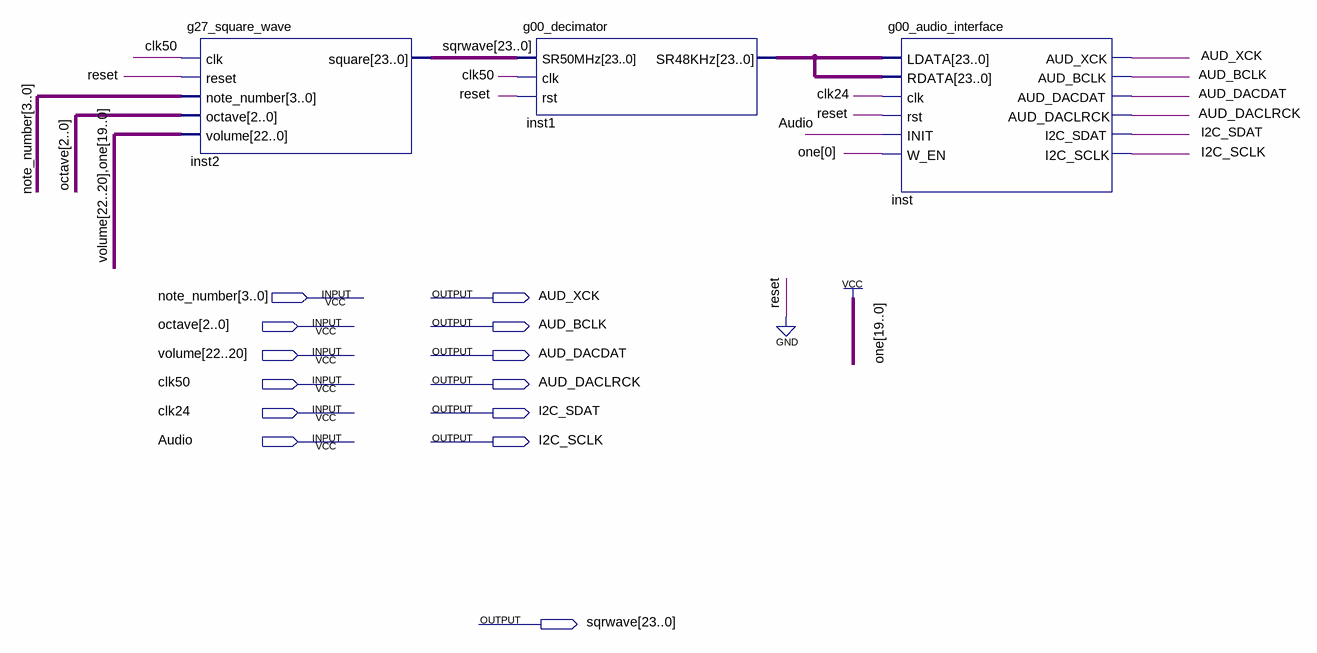
[diagram p0: schematic sheet]
// Quartus schematic g27_squarewave_generator_testbed.bdf as structural Verilog: 3 symbols, 13 pins
module g27_squarewave_generator_testbed (
  input  [3:0] note_number,
  input  [2:0] octave,
  input  [22:20] volume,
  input  clk50,
  input  clk24,
  input  Audio,
  output AUD_XCK,
  output AUD_BCLK,
  output AUD_DACDAT,
  output AUD_DACLRCK,
  output I2C_SDAT,
  output I2C_SCLK,
  output [23:0] sqrwave
);

  wire [23:0] inst1_sr48khz;

  g27_square_wave inst2 (
    .clk(clk50), .reset(1'b0), .note_number(note_number), .octave(octave), .volume({volume, {20{1'b1}}}),
    .square(sqrwave));
  g00_decimator inst1 (.SR50MHz(sqrwave), .clk(clk50), .rst(1'b0), .SR48KHz(inst1_sr48khz));
  g00_audio_interface inst (
    .LDATA(inst1_sr48khz), .RDATA(inst1_sr48khz), .clk(clk24), .rst(1'b0), .INIT(Audio), .W_EN(1'b1),
    .AUD_XCK(AUD_XCK), .AUD_BCLK(AUD_BCLK), .AUD_DACDAT(AUD_DACDAT), .AUD_DACLRCK(AUD_DACLRCK),
    .I2C_SDAT(I2C_SDAT), .I2C_SCLK(I2C_SCLK));
endmodule
